# Altium schematic sheet Power.SchDoc
size A; DocumentNumber: 1; SheetNumber: 1
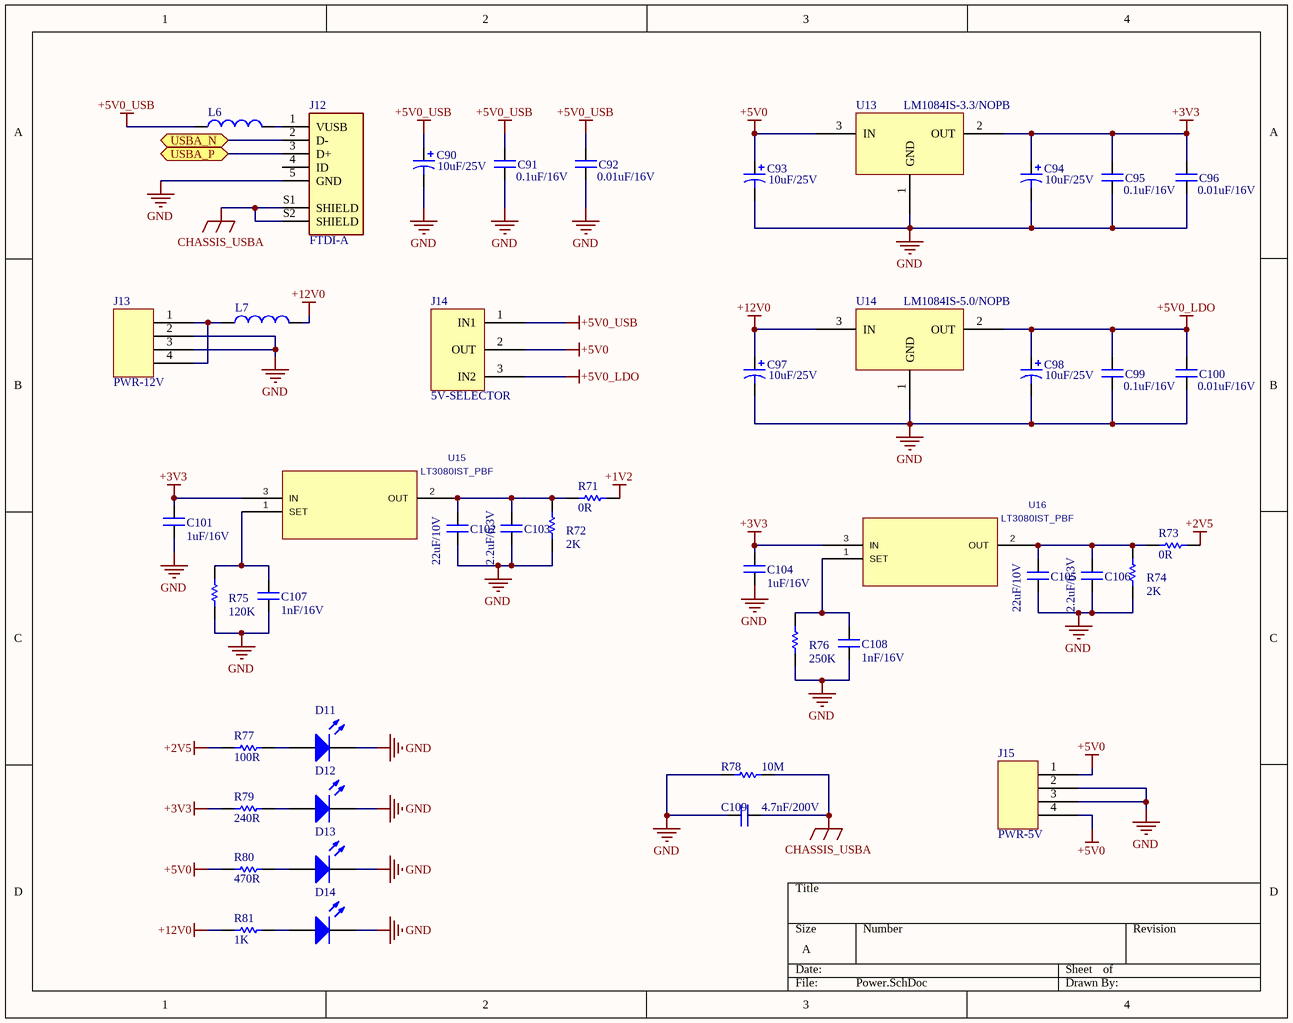
[diagram p0: Power.SchDoc]

## Parts
C90  value 10uF/25V  [CASE-C]  (hidden comment: CASE-C)
C91  value 0.1uF/16V  [CAP_0805]  (hidden comment: CAP_0805)
C92  value 0.01uF/16V  [CAP_0805]  (hidden comment: CAP_0805)
C93  value 10uF/25V  [CASE-C]  (hidden comment: CASE-C)
C94  value 10uF/25V  [CASE-C]  (hidden comment: CASE-C)
C95  value 0.1uF/16V  [CAP_0805]  (hidden comment: CAP_0805)
C96  value 0.01uF/16V  [CAP_0805]  (hidden comment: CAP_0805)
C97  value 10uF/25V  [CASE-C]  (hidden comment: CASE-C)
C98  value 10uF/25V  [CASE-C]  (hidden comment: CASE-C)
C99  value 0.1uF/16V  [CAP_0805]  (hidden comment: CAP_0805)
C100  value 0.01uF/16V  [CAP_0805]  (hidden comment: CAP_0805)
C101  value 1uF/16V  [CAP_0805]  (hidden comment: CAP_0805)
C102  value 22uF/10V  [CAP_0805]  (hidden comment: CAP_0805)
C103  value 2.2uF/6.3V  [CAP_0805]  (hidden comment: CAP_0805)
C104  value 1uF/16V  [CAP_0805]  (hidden comment: CAP_0805)
C105  value 22uF/10V  [CAP_0805]  (hidden comment: CAP_0805)
C106  value 2.2uF/6.3V  [CAP_0805]  (hidden comment: CAP_0805)
C107  value 1nF/16V  [CAP_0805]  (hidden comment: CAP_0805)
C108  value 1nF/16V  [CAP_0805]  (hidden comment: CAP_0805)
C109  value 4.7nF/200V  [CAP_0805]  (hidden comment: CAP_0805)
D11  LED_0603  [LED_0603]  (value not drawn)
D12  LED_0603  [LED_0603]  (value not drawn)
D13  LED_0603  [LED_0603]  (value not drawn)
D14  LED_0603  [LED_0603]  (value not drawn)
J12  FTDI-A  [UX60-MB-5S8]
J13  PWR-12V  [HEADER_4]
J14  5V-SELECTOR  [JUMPER 3 PIN]
J15  PWR-5V  [HEADER_4]
L6  IND_0805  [IND_0805]  (value not drawn)
L7  IND_0805  [IND_0805]  (value not drawn)
R71  value 0R  [RES_0805]  (hidden comment: RES_0805)
R72  value 2K  [RES_0805]  (hidden comment: RES_0805)
R73  value 0R  [RES_0805]  (hidden comment: RES_0805)
R74  value 2K  [RES_0805]  (hidden comment: RES_0805)
R75  value 120K  [RES_0805]  (hidden comment: RES_0805)
R76  value 250K  [RES_0805]  (hidden comment: RES_0805)
R77  value 100R  [RES_0805]  (hidden comment: RES_0805)
R78  value 10M  [RES_0805]  (hidden comment: RES_0805)
R79  value 240R  [RES_0805]  (hidden comment: RES_0805)
R80  value 470R  [RES_0805]  (hidden comment: RES_0805)
R81  value 1K  [RES_0805]  (hidden comment: RES_0805)
U13  LM1084IS-3.3/NOPB  [LM1084IS-3.3/NOPB]
U14  LM1084IS-5.0/NOPB  [LM1084IS-5.0/NOPB]
U15  LT3080IST_PBF  [LT3080IST_PBF]
U16  LT3080IST_PBF  [LT3080IST_PBF]

## Ports
USBA_N (bidir), USBA_P (bidir)

## Nets
+1V2: R71.1
+2V5: R73.1 R77.1
+3V3: C94.A C95.2 C96.2 C101.2 C104.2 R79.1 U13.2(OUT) U15.3(IN) U16.3(IN)
+5V0: C93.A J14.2(OUT) J15.1 J15.4 R80.1 U13.3(IN)
+5V0_LDO: C98.A C99.2 C100.2 J14.3(IN2) U14.2(OUT)
+5V0_USB: C90.A C91.2 C92.2 J14.1(IN1) L6.1
+12V0: C97.A L7.2 R81.1 U14.3(IN)
CHASSIS_USBA: C109.1 J12.S1(SHIELD) J12.S2(SHIELD) R78.1
GND: C90.K C91.1 C92.1 C93.K C94.K C95.1 C96.1 C97.K C98.K C99.1 C100.1 C101.1 C102.1 C103.1 C104.1 C105.1 C106.1 C107.1 C108.1 C109.2 D11.2(K) D12.2(K) D13.2(K) D14.2(K) J12.5(GND) J13.2 J13.3 J15.2 J15.3 R72.1 R74.1 R75.1 R76.1 R78.2 U13.1(GND) U14.1(GND)
USBA_N: J12.2(D-) ; port USBA_N
USBA_P: J12.3(D+) ; port USBA_P
NetC102_2: C102.2 C103.2 R71.2 R72.2 U15.2(OUT)
NetC105_2: C105.2 C106.2 R73.2 R74.2 U16.2(OUT)
NetC107_2: C107.2 R75.2 U15.1(SET)
NetC108_2: C108.2 R76.2 U16.1(SET)
NetD11_1: D11.1(A) R77.2
NetD12_1: D12.1(A) R79.2
NetD13_1: D13.1(A) R80.2
NetD14_1: D14.1(A) R81.2
NetJ12_1: J12.1(VUSB) L6.2
NetJ13_1: J13.1 J13.4 L7.1

Not connected (* = marked no-connect by the designer): J12 4(ID)

## Library data of the parts
J12 = UX60-MB-5S8: USB MINI TYPE B
J13 J15 = HEADER_4
J14 = JUMPER 3 PIN
U15 U16 = LT3080IST_PBF: Manufacturer_Part_Number: LT3080IST#PBF; Vendor: Linear Technology; SourceLibrary: LinearTech_2016-05-13_3; Built_By: EMA_UL_Team; Value: LT3080IST_PBF
U13 = LM1084IS-3.3/NOPB: Supplier 1: Digi-Key; Supplier Part Number 1: 296-35390-1-ND
U14 = LM1084IS-5.0/NOPB: Supplier 1: Digi-Key; Supplier Part Number 1: 296-35390-1-ND